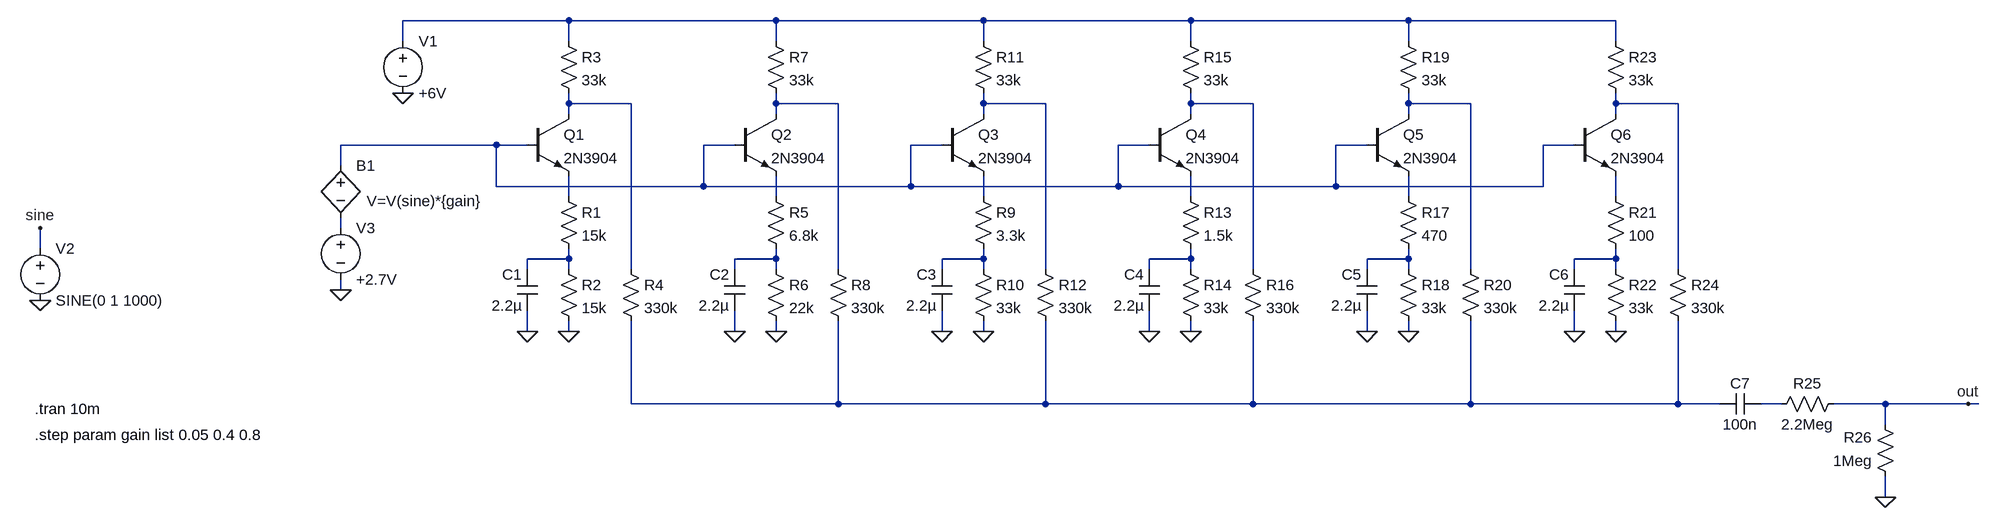
[diagram p0: schematic distortion.asc]
distortion.asc, the LTspice schematic file:
Version 4
SHEET 1 4148 680
WIRE 1280 -176 1024 -176
WIRE 1600 -176 1280 -176
WIRE 1920 -176 1600 -176
WIRE 2240 -176 1920 -176
WIRE 2576 -176 2240 -176
WIRE 2896 -176 2576 -176
WIRE 1024 -144 1024 -176
WIRE 1280 -144 1280 -176
WIRE 1600 -144 1600 -176
WIRE 1920 -144 1920 -176
WIRE 2240 -144 2240 -176
WIRE 2576 -144 2576 -176
WIRE 2896 -144 2896 -176
WIRE 1280 -48 1280 -64
WIRE 1376 -48 1280 -48
WIRE 1600 -48 1600 -64
WIRE 1696 -48 1600 -48
WIRE 1920 -48 1920 -64
WIRE 2016 -48 1920 -48
WIRE 2240 -48 2240 -64
WIRE 2336 -48 2240 -48
WIRE 2576 -48 2576 -64
WIRE 2672 -48 2576 -48
WIRE 2896 -48 2896 -64
WIRE 2992 -48 2896 -48
WIRE 1280 -32 1280 -48
WIRE 1600 -32 1600 -48
WIRE 1920 -32 1920 -48
WIRE 2240 -32 2240 -48
WIRE 2576 -32 2576 -48
WIRE 2896 -32 2896 -48
WIRE 1168 16 928 16
WIRE 1216 16 1168 16
WIRE 1536 16 1488 16
WIRE 1856 16 1808 16
WIRE 2176 16 2128 16
WIRE 2512 16 2464 16
WIRE 2832 16 2784 16
WIRE 928 48 928 16
WIRE 1168 80 1168 16
WIRE 1488 80 1488 16
WIRE 1488 80 1168 80
WIRE 1808 80 1808 16
WIRE 1808 80 1488 80
WIRE 2128 80 2128 16
WIRE 2128 80 1808 80
WIRE 2464 80 2464 16
WIRE 2464 80 2128 80
WIRE 2784 80 2784 16
WIRE 2784 80 2464 80
WIRE 1280 96 1280 64
WIRE 1600 96 1600 64
WIRE 1920 96 1920 64
WIRE 2240 96 2240 64
WIRE 2576 96 2576 64
WIRE 2896 96 2896 64
WIRE 928 144 928 128
WIRE 464 176 464 144
WIRE 1280 192 1280 176
WIRE 1280 192 1216 192
WIRE 1600 192 1600 176
WIRE 1600 192 1536 192
WIRE 1920 192 1920 176
WIRE 1920 192 1856 192
WIRE 2240 192 2240 176
WIRE 2240 192 2176 192
WIRE 2576 192 2576 176
WIRE 2576 192 2512 192
WIRE 2896 192 2896 176
WIRE 2896 192 2832 192
WIRE 1216 208 1216 192
WIRE 1280 208 1280 192
WIRE 1376 208 1376 -48
WIRE 1536 208 1536 192
WIRE 1600 208 1600 192
WIRE 1696 208 1696 -48
WIRE 1856 208 1856 192
WIRE 1920 208 1920 192
WIRE 2016 208 2016 -48
WIRE 2176 208 2176 192
WIRE 2240 208 2240 192
WIRE 2336 208 2336 -48
WIRE 2512 208 2512 192
WIRE 2576 208 2576 192
WIRE 2672 208 2672 -48
WIRE 2832 208 2832 192
WIRE 2896 208 2896 192
WIRE 2992 208 2992 -48
WIRE 928 240 928 224
WIRE 1216 304 1216 272
WIRE 1280 304 1280 288
WIRE 1536 304 1536 272
WIRE 1600 304 1600 288
WIRE 1856 304 1856 272
WIRE 1920 304 1920 288
WIRE 2176 304 2176 272
WIRE 2240 304 2240 288
WIRE 2512 304 2512 272
WIRE 2576 304 2576 288
WIRE 2832 304 2832 272
WIRE 2896 304 2896 288
WIRE 1376 416 1376 288
WIRE 1696 416 1696 288
WIRE 1696 416 1376 416
WIRE 2016 416 2016 288
WIRE 2016 416 1696 416
WIRE 2336 416 2336 288
WIRE 2336 416 2016 416
WIRE 2672 416 2672 288
WIRE 2672 416 2336 416
WIRE 2992 416 2992 288
WIRE 2992 416 2672 416
WIRE 3056 416 2992 416
WIRE 3152 416 3120 416
WIRE 3312 416 3232 416
WIRE 3440 416 3312 416
WIRE 3456 416 3440 416
WIRE 3312 448 3312 416
WIRE 3312 560 3312 528
FLAG 1024 -64 0
FLAG 464 256 0
FLAG 1280 304 0
FLAG 1216 304 0
FLAG 1600 304 0
FLAG 1536 304 0
FLAG 1920 304 0
FLAG 1856 304 0
FLAG 2240 304 0
FLAG 2176 304 0
FLAG 2576 304 0
FLAG 2512 304 0
FLAG 2896 304 0
FLAG 2832 304 0
FLAG 3440 416 out
FLAG 464 144 sine
FLAG 928 240 0
FLAG 3312 560 0
SYMBOL voltage 1024 -160 R0
WINDOW 123 0 0 Left 0
WINDOW 39 0 0 Left 0
SYMATTR InstName V1
SYMATTR Value +6V
SYMBOL voltage 464 160 R0
WINDOW 123 0 0 Left 0
WINDOW 39 0 0 Left 0
SYMATTR InstName V2
SYMATTR Value SINE(0 1 1000)
SYMBOL cap 1232 272 R180
WINDOW 0 24 56 Left 2
WINDOW 3 24 8 Left 2
SYMATTR InstName C1
SYMATTR Value 2.2µ
SYMBOL npn 1216 -32 R0
SYMATTR InstName Q1
SYMATTR Value 2N3904
SYMBOL res 1264 80 R0
SYMATTR InstName R1
SYMATTR Value 15k
SYMBOL res 1264 192 R0
SYMATTR InstName R2
SYMATTR Value 15k
SYMBOL res 1264 -160 R0
SYMATTR InstName R3
SYMATTR Value 33k
SYMBOL res 1360 192 R0
SYMATTR InstName R4
SYMATTR Value 330k
SYMBOL cap 1552 272 R180
WINDOW 0 24 56 Left 2
WINDOW 3 24 8 Left 2
SYMATTR InstName C2
SYMATTR Value 2.2µ
SYMBOL npn 1536 -32 R0
SYMATTR InstName Q2
SYMATTR Value 2N3904
SYMBOL res 1584 80 R0
SYMATTR InstName R5
SYMATTR Value 6.8k
SYMBOL res 1584 192 R0
SYMATTR InstName R6
SYMATTR Value 22k
SYMBOL res 1584 -160 R0
SYMATTR InstName R7
SYMATTR Value 33k
SYMBOL res 1680 192 R0
SYMATTR InstName R8
SYMATTR Value 330k
SYMBOL cap 1872 272 R180
WINDOW 0 24 56 Left 2
WINDOW 3 24 8 Left 2
SYMATTR InstName C3
SYMATTR Value 2.2µ
SYMBOL npn 1856 -32 R0
SYMATTR InstName Q3
SYMATTR Value 2N3904
SYMBOL res 1904 80 R0
SYMATTR InstName R9
SYMATTR Value 3.3k
SYMBOL res 1904 192 R0
SYMATTR InstName R10
SYMATTR Value 33k
SYMBOL res 1904 -160 R0
SYMATTR InstName R11
SYMATTR Value 33k
SYMBOL res 2000 192 R0
SYMATTR InstName R12
SYMATTR Value 330k
SYMBOL cap 2192 272 R180
WINDOW 0 24 56 Left 2
WINDOW 3 24 8 Left 2
SYMATTR InstName C4
SYMATTR Value 2.2µ
SYMBOL npn 2176 -32 R0
SYMATTR InstName Q4
SYMATTR Value 2N3904
SYMBOL res 2224 80 R0
SYMATTR InstName R13
SYMATTR Value 1.5k
SYMBOL res 2224 192 R0
SYMATTR InstName R14
SYMATTR Value 33k
SYMBOL res 2224 -160 R0
SYMATTR InstName R15
SYMATTR Value 33k
SYMBOL res 2320 192 R0
SYMATTR InstName R16
SYMATTR Value 330k
SYMBOL cap 2528 272 R180
WINDOW 0 24 56 Left 2
WINDOW 3 24 8 Left 2
SYMATTR InstName C5
SYMATTR Value 2.2µ
SYMBOL npn 2512 -32 R0
SYMATTR InstName Q5
SYMATTR Value 2N3904
SYMBOL res 2560 80 R0
SYMATTR InstName R17
SYMATTR Value 470
SYMBOL res 2560 192 R0
SYMATTR InstName R18
SYMATTR Value 33k
SYMBOL res 2560 -160 R0
SYMATTR InstName R19
SYMATTR Value 33k
SYMBOL res 2656 192 R0
SYMATTR InstName R20
SYMATTR Value 330k
SYMBOL cap 2848 272 R180
WINDOW 0 24 56 Left 2
WINDOW 3 24 8 Left 2
SYMATTR InstName C6
SYMATTR Value 2.2µ
SYMBOL npn 2832 -32 R0
SYMATTR InstName Q6
SYMATTR Value 2N3904
SYMBOL res 2880 80 R0
SYMATTR InstName R21
SYMATTR Value 100
SYMBOL res 2880 192 R0
SYMATTR InstName R22
SYMATTR Value 33k
SYMBOL res 2880 -160 R0
SYMATTR InstName R23
SYMATTR Value 33k
SYMBOL res 2976 192 R0
SYMATTR InstName R24
SYMATTR Value 330k
SYMBOL bv 928 32 R0
WINDOW 3 40 71 Left 2
SYMATTR Value V=V(sine)*{gain}
SYMATTR InstName B1
SYMBOL voltage 928 128 R0
WINDOW 123 0 0 Left 0
WINDOW 39 0 0 Left 0
SYMATTR InstName V3
SYMATTR Value +2.7V
SYMBOL cap 3120 400 R90
WINDOW 0 0 32 VBottom 2
WINDOW 3 32 32 VTop 2
SYMATTR InstName C7
SYMATTR Value 100n
SYMBOL res 3248 400 R90
WINDOW 0 0 56 VBottom 2
WINDOW 3 32 56 VTop 2
SYMATTR InstName R25
SYMATTR Value 2.2Meg
SYMBOL res 3328 544 R180
WINDOW 0 36 76 Left 2
WINDOW 3 36 40 Left 2
SYMATTR InstName R26
SYMATTR Value 1Meg
TEXT 456 464 Left 2 !.step param gain list 0.05 0.4 0.8
TEXT 456 424 Left 2 !.tran 10m

The netlist it stands for:
* distortion.asc
V1 N001 0 +6V
V2 sine 0 SINE(0 1 1000)
C1 0 N016 2.2µ
Q1 N002 N008 N009 0 2N3904
R1 N009 N016 15k
R2 N016 0 15k
R3 N001 N002 33k
R4 N002 N022 330k
C2 0 N017 2.2µ
Q2 N003 N008 N010 0 2N3904
R5 N010 N017 6.8k
R6 N017 0 22k
R7 N001 N003 33k
R8 N003 N022 330k
C3 0 N018 2.2µ
Q3 N004 N008 N011 0 2N3904
R9 N011 N018 3.3k
R10 N018 0 33k
R11 N001 N004 33k
R12 N004 N022 330k
C4 0 N019 2.2µ
Q4 N005 N008 N012 0 2N3904
R13 N012 N019 1.5k
R14 N019 0 33k
R15 N001 N005 33k
R16 N005 N022 330k
C5 0 N020 2.2µ
Q5 N006 N008 N013 0 2N3904
R17 N013 N020 470
R18 N020 0 33k
R19 N001 N006 33k
R20 N006 N022 330k
C6 0 N021 2.2µ
Q6 N007 N008 N014 0 2N3904
R21 N014 N021 100
R22 N021 0 33k
R23 N001 N007 33k
R24 N007 N022 330k
B1 N008 N015 V=V(sine)*{gain}
V3 N015 0 +2.7V
C7 N023 N022 100n
R25 out N023 2.2Meg
R26 0 out 1Meg
.model NPN NPN
.model PNP PNP
.lib standard.bjt
.step param gain list 0.05 0.4 0.8
.tran 10m
.backanno
.end